# Altium schematic sheet 01_EFR32xG1x_DISC_REF_DES_A00_TitlePage.SchDoc
size 420 x 297 mm
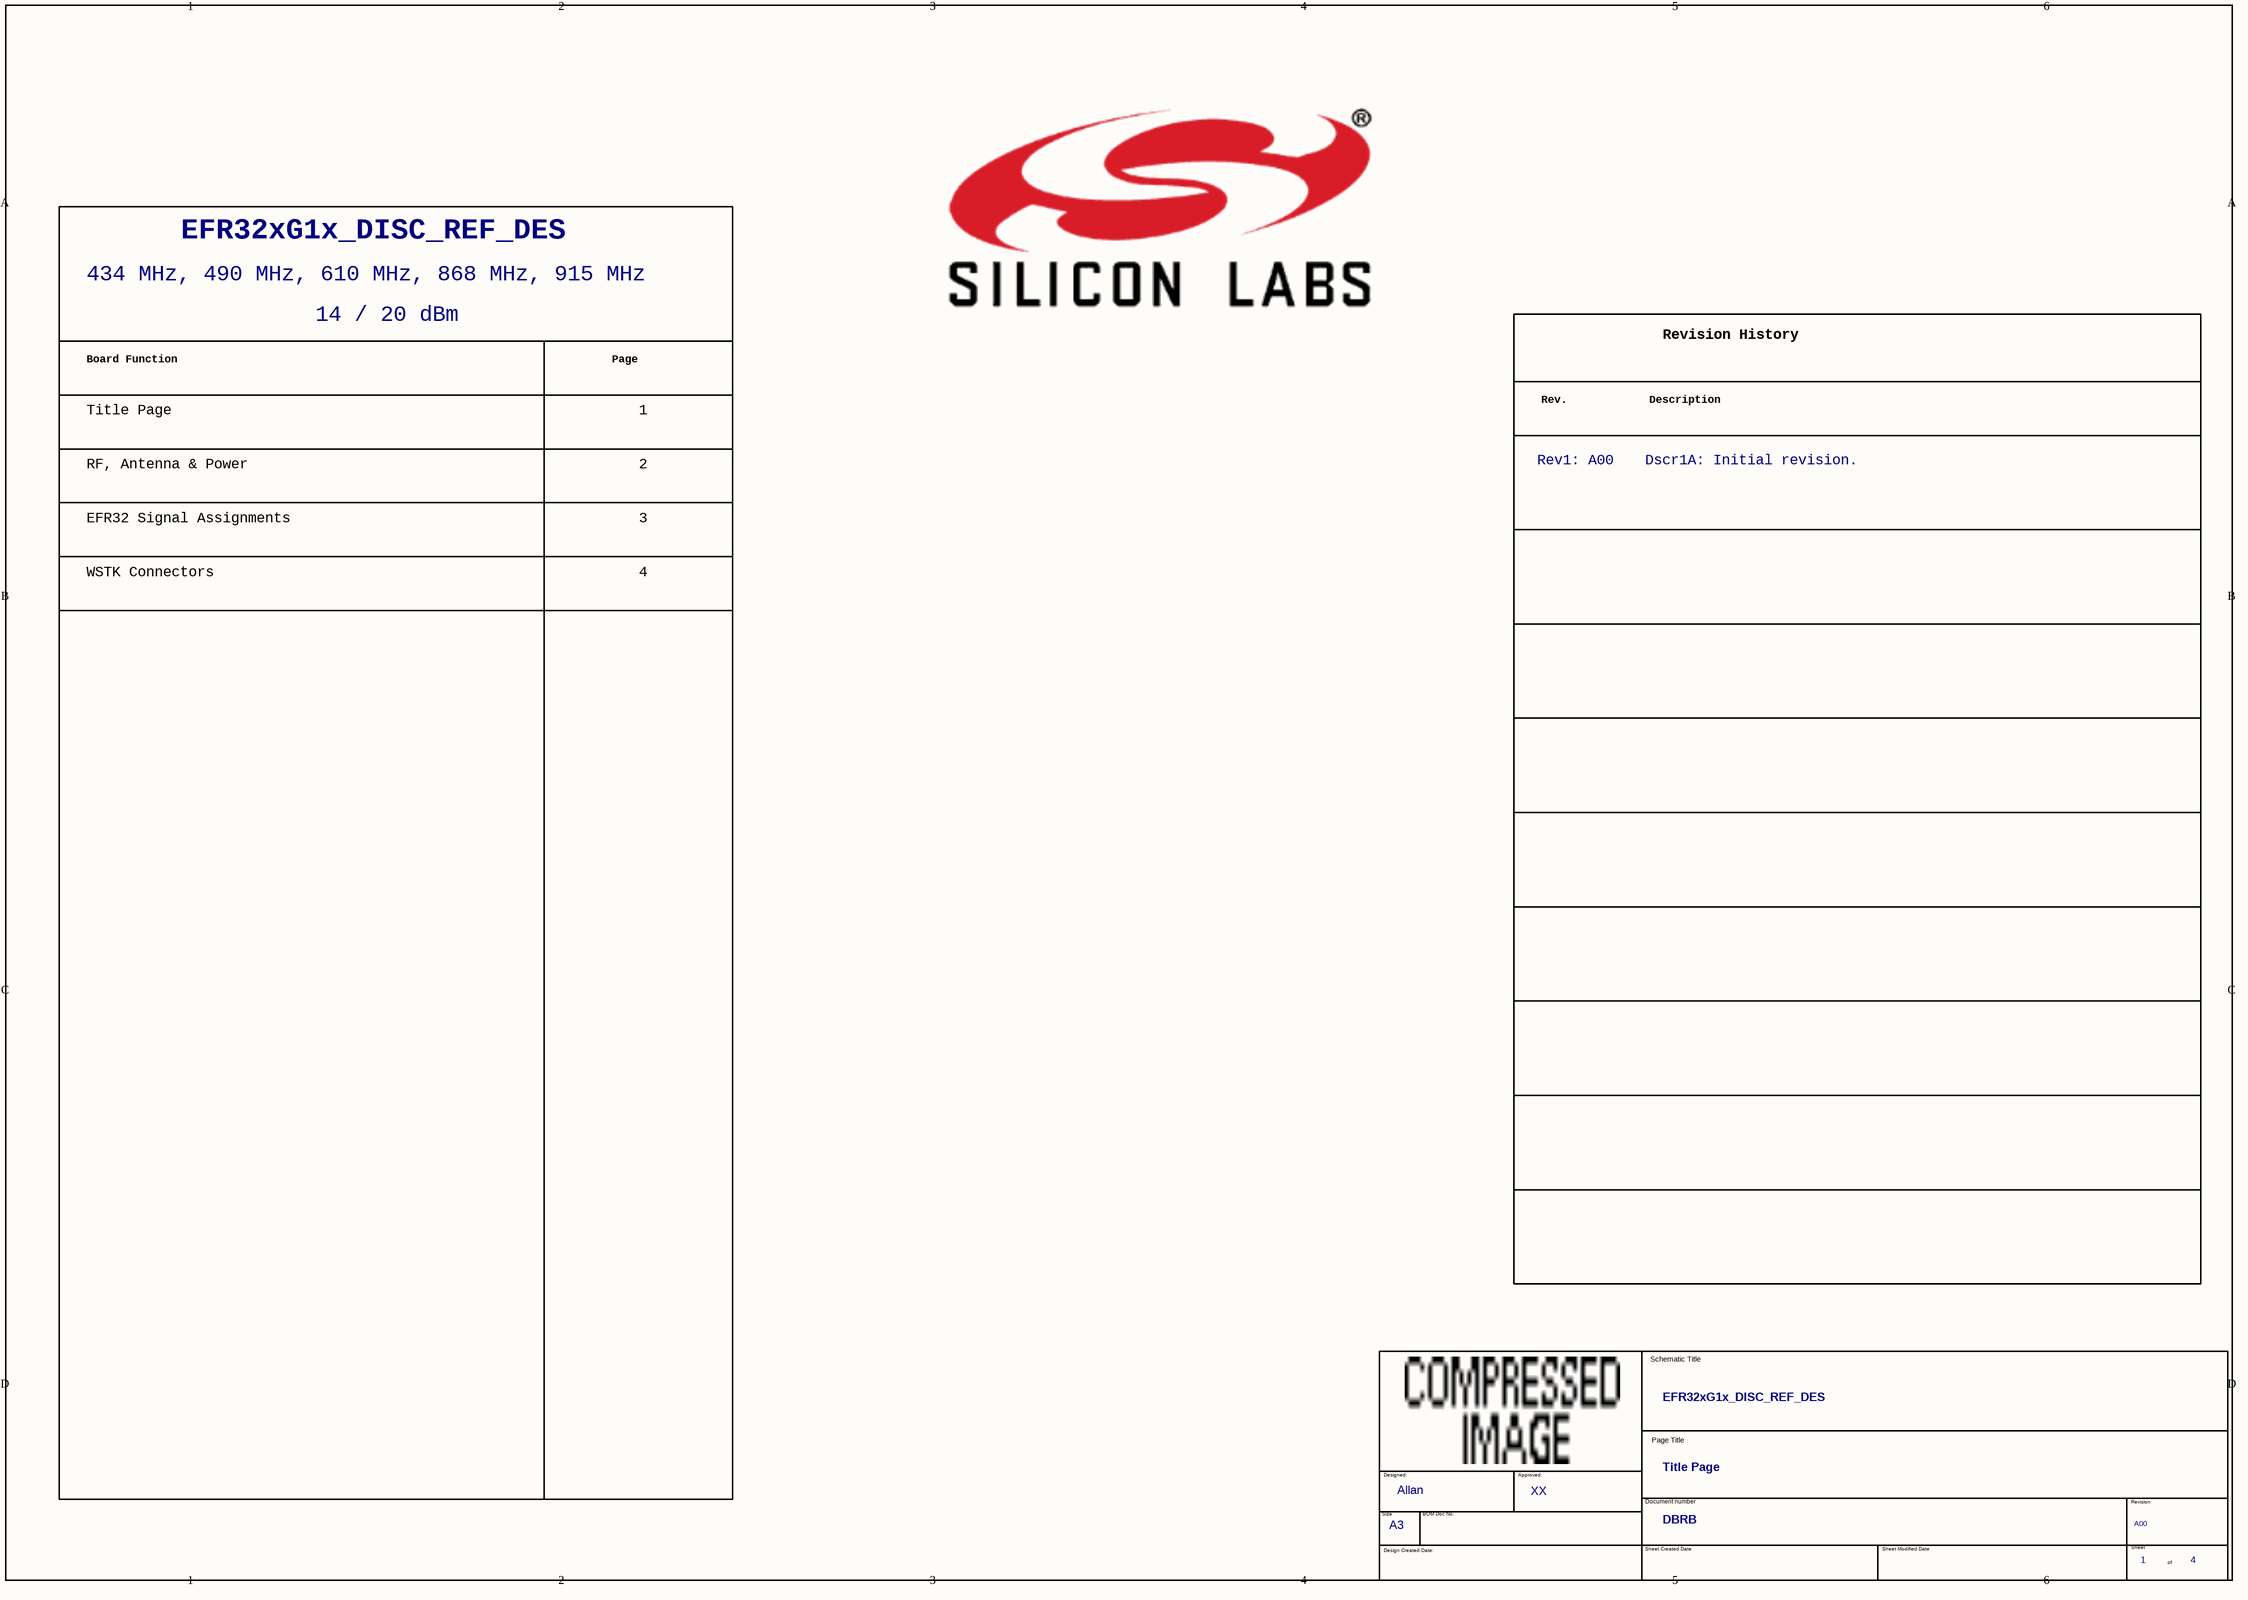
[diagram p0: 01_EFR32xG1x_DISC_REF_DES_A00_TitlePage.SchDoc]

## Parts
(Parts that share a designator on the sheet are numbered #1, #2 ... from top to bottom, then left to right.)
*#1  Header A: EFR32xG1x_DISC_REF_DES  (hidden comment: Toc_Header)  (graphical)
*#2  Dscr1A: Initial revision.  Rev1: A00  (hidden comment: Rev_History)  (graphical)
*#3  OrgAddr2: XX  OrgAddr1: Allan  Page Count: 4  Page Number: 1  Doc: DBRB  Title: EFR32xG1x_DISC_REF_DES  RevCode: A00  Page Size: A3  Page Title: Title Page  (hidden comment: TitleBlock_EnergyMicro_A3)  (graphical)

## Notes on the sheet
- 434 MHz, 490 MHz, 610 MHz, 868 MHz, 915 MHz
- 14 / 20 dBm
- Board Function
- Page
- Title Page
- 1
- EFR32 Signal Assignments
- RF, Antenna & Power
- 2
- 3
- WSTK Connectors
- 4
- (in symbol Rev_History) Revision History; Rev.; Description
- (in symbol TitleBlock_EnergyMicro_A3) Schematic Title; Page Title; Designed:; Approved:; Document number; Revision; Size; BOM Doc No:; Design Created Date:; Sheet Created Date; Sheet Modified Date; Sheet; of

## Library data of the parts
*#1 = Toc_Header: Doc: BRD4259A; Page Count: 5; Page Number: 1; OrgName: Silicon Labs; RevCode: A01
*#2 = Rev_History: Doc: BRD4259A; RevCode: A01; Title: EFR32FG14 2.4 GHz / 434 MHz 10 dBm Radio Board; OrgAddr2: JNO; OrgAddr1: JSH; OrgName: Silicon Labs; Page Number: 1; Page Count: 5